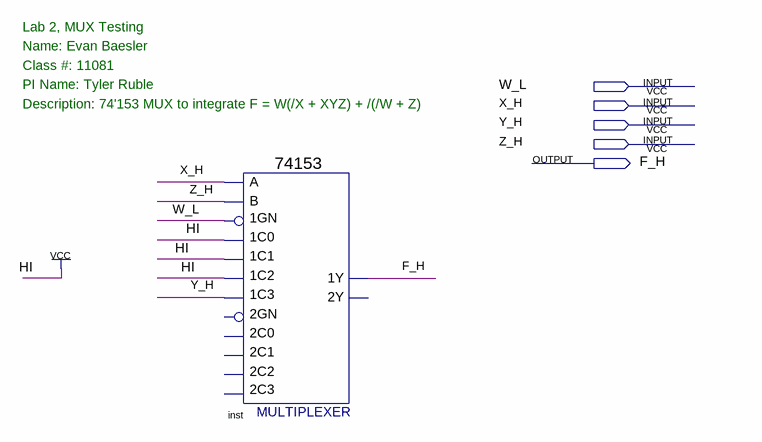
[diagram p0: schematic sheet]
// Quartus schematic lab2_EQU.bdf as structural Verilog: 1 symbols, 5 pins
module lab2_EQU (
  input  W_L,
  input  X_H,
  input  Y_H,
  input  Z_H,
  output F_H
);

  \74153  inst (
    .\1C1 (1'b1), .\1GN (W_L), .\1C0 (1'b1), .\1C2 (1'b1), .\1C3 (Y_H), .B(Z_H), .A(X_H), .\1Y (F_H));  // open: 2C0, 2GN, 2C2, 2C1, 2C3, 2Y

  // Notes on the sheet:
  //   Lab 2, MUX Testing
  //   Name: Evan Baesler
  //   Class #: 11081
  //   PI Name: Tyler Ruble
  //   Description: 74'153 MUX to integrate F = W(/X + XYZ) + /(/W + Z)
endmodule
